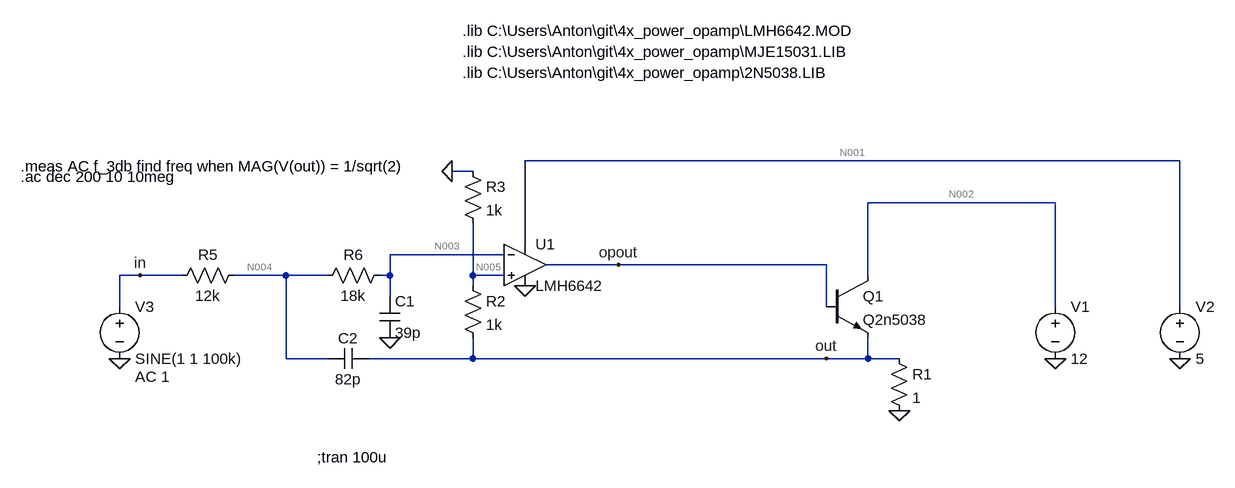
[diagram p0: schematic sim.asc]
sim.asc, the LTspice schematic file:
Version 4
SHEET 1 984 680
WIRE 816 -64 -192 -64
WIRE -272 -48 -304 -48
WIRE 624 0 336 0
WIRE -192 64 -192 -64
WIRE -224 80 -400 80
WIRE -48 96 -160 96
WIRE 272 96 -48 96
WIRE -784 112 -816 112
WIRE -720 112 -784 112
WIRE -560 112 -640 112
WIRE -496 112 -560 112
WIRE -400 112 -400 80
WIRE -400 112 -416 112
WIRE -272 112 -272 32
WIRE -224 112 -272 112
WIRE 336 112 336 0
WIRE -272 128 -272 112
WIRE -400 144 -400 112
WIRE -816 160 -816 112
WIRE 272 160 272 96
WIRE 624 160 624 0
WIRE 816 160 816 -64
WIRE -560 240 -560 112
WIRE -496 240 -560 240
WIRE -272 240 -272 208
WIRE -272 240 -432 240
WIRE 272 240 -272 240
WIRE 336 240 336 208
WIRE 336 240 272 240
WIRE 384 240 336 240
FLAG 624 240 0
FLAG -816 240 0
FLAG -784 112 in
FLAG 272 240 out
FLAG -400 208 0
FLAG -48 96 opout
FLAG 384 320 0
FLAG -192 128 0
FLAG 816 240 0
FLAG -304 -48 0
SYMBOL npn 272 112 R0
SYMATTR InstName Q1
SYMATTR Value Q2n5038
SYMBOL res 368 224 R0
SYMATTR InstName R1
SYMATTR Value 1
SYMBOL voltage 624 144 R0
WINDOW 123 0 0 Left 0
WINDOW 39 0 0 Left 0
SYMATTR InstName V1
SYMATTR Value 12
SYMBOL voltage 816 144 R0
WINDOW 123 0 0 Left 0
WINDOW 39 0 0 Left 0
SYMATTR InstName V2
SYMATTR Value 5
SYMBOL voltage -816 144 R0
WINDOW 123 24 124 Left 2
WINDOW 39 0 0 Left 0
SYMATTR Value2 AC 1
SYMATTR InstName V3
SYMATTR Value SINE(1 1 100k)
SYMBOL res -624 96 R90
WINDOW 0 0 56 VBottom 2
WINDOW 3 32 56 VTop 2
SYMATTR InstName R5
SYMATTR Value 12k
SYMBOL res -400 96 R90
WINDOW 0 0 56 VBottom 2
WINDOW 3 32 56 VTop 2
SYMATTR InstName R6
SYMATTR Value 18k
SYMBOL cap -416 144 R0
SYMATTR InstName C1
SYMATTR Value 39p
SYMBOL cap -432 224 R90
WINDOW 0 0 32 VBottom 2
WINDOW 3 32 32 VTop 2
SYMATTR InstName C2
SYMATTR Value 82p
SYMBOL OpAmps\\opamp2 -192 32 R0
SYMATTR InstName U1
SYMATTR Value LMH6642
SYMBOL res -288 112 R0
SYMATTR InstName R2
SYMATTR Value 1k
SYMBOL res -288 -64 R0
SYMATTR InstName R3
SYMATTR Value 1k
TEXT -288 -264 Left 2 !.lib C:\\Users\\Anton\\git\\4x_power_opamp\\LMH6642.MOD
TEXT -288 -232 Left 2 !.lib C:\\Users\\Anton\\git\\4x_power_opamp\\MJE15031.LIB
TEXT -512 392 Left 2 !;tran 100u
TEXT -288 -200 Left 2 !.lib C:\\Users\\Anton\\git\\4x_power_opamp\\2N5038.LIB
TEXT -968 -40 Left 2 !.ac dec 200 10 10meg
TEXT -968 -56 Left 2 !.meas AC f_3db find freq when MAG(V(out)) = 1/sqrt(2)

The netlist it stands for:
* sim.asc
Q1 N002 opout out 0 Q2n5038
R1 out 0 1
V1 N002 0 12
V2 N001 0 5
V3 in 0 SINE(1 1 100k) AC 1
R5 N004 in 12k
R6 N003 N004 18k
C1 N003 0 39p
C2 out N004 82p
XU1 N005 N003 N001 0 opout LMH6642  ; pins In+ In- V+ V- OUT
R2 N005 out 1k
R3 0 N005 1k
.model NPN NPN
.model PNP PNP
.lib standard.bjt
.lib C:\Users\Anton\git\4x_power_opamp\LMH6642.MOD
.lib C:\Users\Anton\git\4x_power_opamp\MJE15031.LIB
;tran 100u
.lib C:\Users\Anton\git\4x_power_opamp\2N5038.LIB
.ac dec 200 10 10meg
.meas AC f_3db find freq when MAG(V(out)) = 1/sqrt(2)
.backanno
.end

* Results of the author's LTspice run, read from the files saved beside the schematic
* Operating Point, zero values left out:
*   V(n002) = 12 V
*   V(opout) = 2.79 V
*   V(out) = 2.1 V
*   V(n001) = 5 V
*   V(in) = 1 V
*   V(n004) = 1.019 V
*   V(n003) = 1.048 V
*   V(n005) = 1.051 V
*   Ic(Q1) = 2.084 A
*   Ib(Q1) = 17.5 mA
*   Ie(Q1) = -2.101 A
*   I(R3) = -1.051 mA
*   I(R2) = -1.049 mA
*   I(R6) = 1.608 µA
*   I(R5) = 1.608 µA
*   I(R1) = 2.1 A
*   I(V3) = 1.608 µA
*   I(V2) = -20.49 mA
*   I(V1) = -2.084 A
*   Ix(u1:2) = -1.586 µA
*   Ix(u1:3) = -1.608 µA
*   Ix(u1:7) = 20.49 mA
*   Ix(u1:4) = -2.981 mA
*   Ix(u1:6) = -17.5 mA
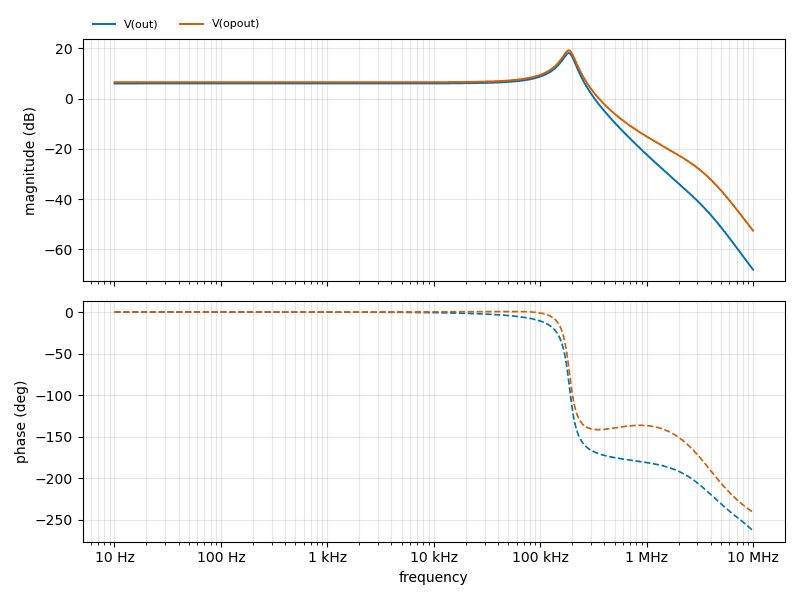
[diagram p1: AC Analysis of sim.asc, plotted from the saved traces]
* AC Analysis, 1 run:
*   V(out): 6.02 dB at 10 Hz, -68.15 dB at 10 MHz, peak 18.11 dB at 186.2 kHz, 3 dB below the peak at 159.7 kHz and 207.8 kHz
*   V(opout): 6.52 dB at 10 Hz, -52.61 dB at 10 MHz, peak 19.19 dB at 186.2 kHz, 3 dB below the peak at 160.6 kHz and 208.4 kHz
* From the log:
*   f_3db: freq=(111.299dB,0°) at 367237